# EAGLE design hoperf-rfm9x-lora-breakout (EAGLE 7.6.0)
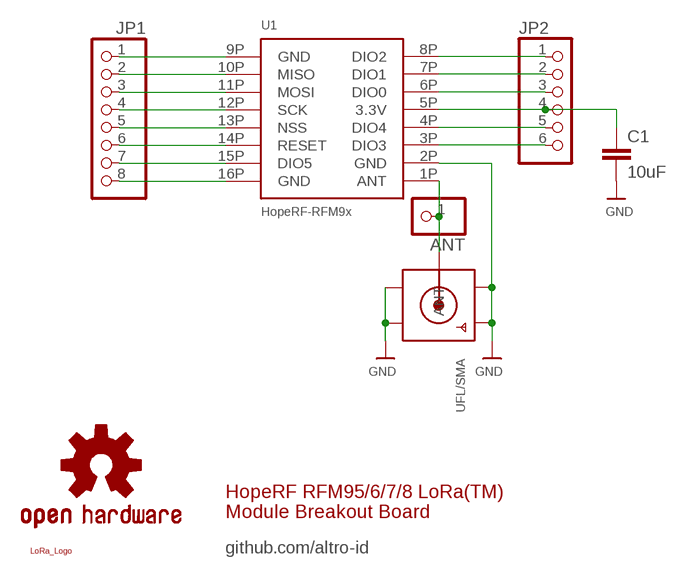
[diagram p0: schematic, sheet 1]

## Parts
ANT  HEADER-1X1ROUND  [1X01_ROUND]
C1  10uF  CAP0805  [0805_MP]
JP1  HEADER-1X876MIL  [1X08_ROUND_76]
JP2  HEADER-1X676MIL  [1X06_ROUND_76]
LOGO1  OSHW-LOGOS  [OSHW-LOGO-S]
U1  HopeRF-RFM9x  RFM9X_LORA  [RFM9X_SMT]
U$3  LORA_LOGO  [LORA_LOGO]
UFL/SMA  MICROBUILDER_SMACONNECTOR_EDGE_UFL  [MICROBUILDER_SMA_EDGELAUNCH_UFL]

## Nets
3.3V: C1.1 JP2.4 U1.5P(3.3V)
DIO0: JP2.3 U1.6P(DIO0)
DIO1: JP2.2 U1.7P(DIO1)
DIO2: JP2.1 U1.8P(DIO2)
DIO3: JP2.6 U1.3P(DIO3)
DIO4: JP2.5 U1.4P(DIO4)
DIO5: JP1.7 U1.15P(DIO5)
GND: C1.2 JP1.1 JP1.8 U1.2P(GND) U1.9P(GND) U1.16P(GND) UFL/SMA.GND@1(GND1) UFL/SMA.GND@2(GND2) UFL/SMA.GND@3(GND3) UFL/SMA.GND@4(GND4)
MISO: JP1.2 U1.10P(MISO)
MOSI: JP1.3 U1.11P(MOSI)
N$17: ANT.1 U1.1P(ANT) UFL/SMA.P(ANT)
NSS: JP1.5 U1.13P(NSS)
RESET: JP1.6 U1.14P(RESET)
SCK: JP1.4 U1.12P(SCK)

## Notes on the sheet
- HopeRF RFM95/6/7/8 LoRa(TM)
  Module Breakout Board
- github.com/altro-id

## Library data of the parts
ANT = microbuilder:HEADER-1X1: PIN HEADER
C1 = #afb-Passives:CAP
JP1 = microbuilder:HEADER-1X8: PIN HEADER
JP2 = microbuilder:HEADER-1X6: PIN HEADER
LOGO1 = SparkFun-Aesthetics:OSHW-LOGO: Open-Source Hardware (OSHW) Logo This logo indicates the piece of hardware it is found on incorporates a OSHW license and/or adheres to the definition of open source hardware found here: http://freedomdefined.org/OSHW
U1 = #afb-Boards:RFM9X_LORA: HopeRF RFM95/96/97/98 LoRa Module
U$3 = #afb-Aesthetics:LORA_LOGO
UFL/SMA = #afb-Connectors:MICROBUILDER_SMACONNECTOR: SMA Connector 90° DIP SMA Connector, 50 Ohm (4UConnector: 07259)

## Board
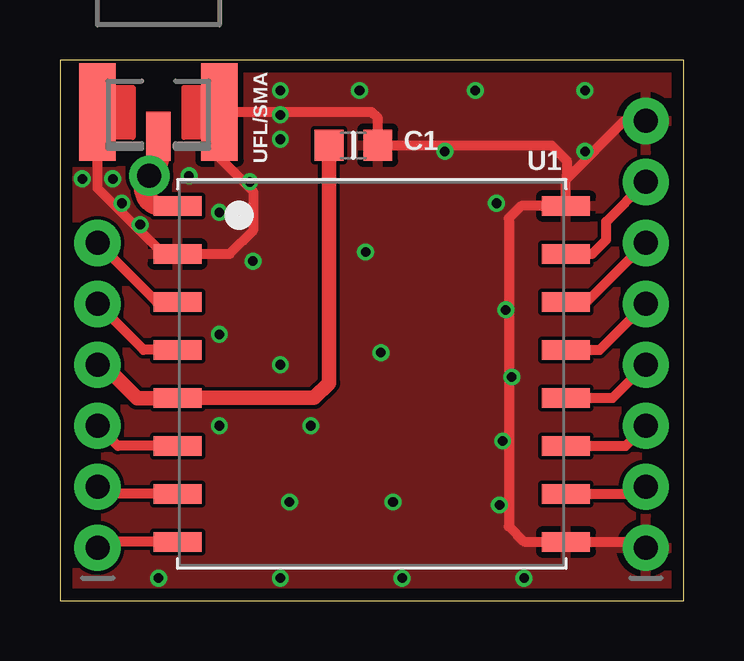
[diagram p1: board, top side]
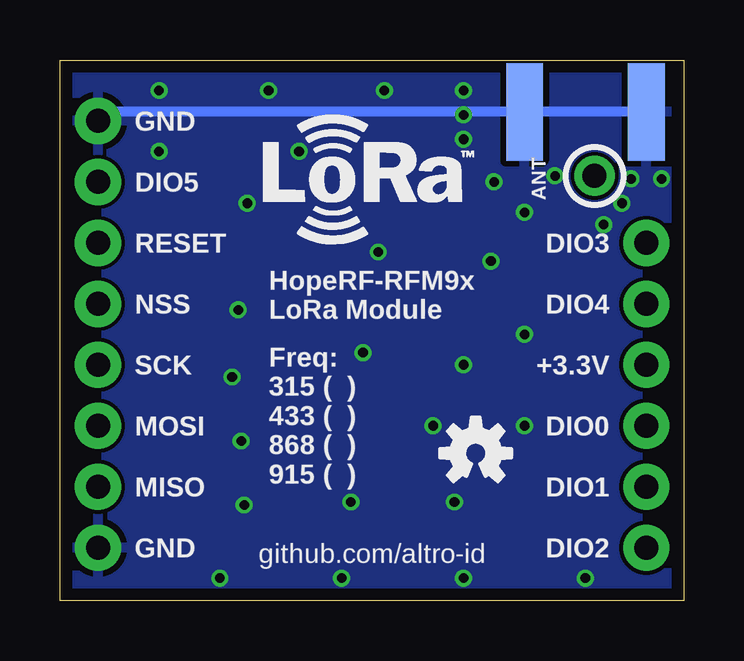
[diagram p2: board, bottom side, seen from below]

Size 26.02 x 22.53 mm. Coordinates in mm from the lower left corner, seen from the top.
Outline: 26.02,22.53 0,22.53 0,0 26.02,0 26.02,22.53
Copper layers (1*16): Top 0.035mm / dielectric 1.6mm / Bottom 0.035mm
Design rules "Elecrow_2-layer_PCB_eagle_rule": minimum track width 6mil, minimum drill 12mil, track to track 6mil, track to pad 6mil, pad to pad 6mil, via to via 8mil, smd to smd 0mil, copper to edge 20mil, drill to drill 10mil, minimum pad ring 6mil, minimum via ring 6mil, stop-mask expansion 0mil, vias tented up to drill 100mil, thermal gap 10mil

### Footprints (pad centres in the part's own frame; a part is rotated, then mirrored left to right if it is on the bottom)
1X01_ROUND = drill 1 pad 1.676: 1 0,0
0805_MP = smd 1.2 x 1.3: 1 -1.016,0; 2 1.016,0
1X08_ROUND_76 = drill 1 pad 1.93: 1 -8.89,0; 2 -6.35,0; 3 -3.81,0; 4 -1.27,0; 5 1.27,0; 6 3.81,0; 7 6.35,0; 8 8.89,0
1X06_ROUND_76 = drill 1 pad 1.93: 1 -6.35,0; 2 -3.81,0; 3 -1.27,0; 4 1.27,0; 5 3.81,0; 6 6.35,0
RFM9X_SMT = smd 2 x 0.8: 1P 8.1,-7; 2P 8.1,-5; 3P 8.1,-3; 4P 8.1,-1; 5P 8.1,1; 6P 8.1,3; 7P 8.1,5; 8P 8.1,7; 9P -8.1,7; 10P -8.1,5; 11P -8.1,3; 12P -8.1,1; 13P -8.1,-1; 14P -8.1,-3; 15P -8.1,-5; 16P -8.1,-7
MICROBUILDER_SMA_EDGELAUNCH_UFL = smd 4.064 x 1.524: GND@1 2.032,-2.54; GND@2 2.032,2.54 | smd 4.064 x 1.524 bottom: GND@3 2.032,2.54; GND@4 2.032,-2.54 | smd 2.032 x 1.016: P 3.048,0

### Placement (x,y rotation side)
ANT  3.73,17.7 180 top
C1  12.24,18.97 0 top
JP1  24.43,11.1 90 top
JP2  1.57,8.56 90 top
LOGO1  8.68,6.15 0 bottom
U1  13,9.45 180 top
U$3  17.95,14.15 0 bottom
UFL/SMA  4.11,22.4 270 top

### Tracks (layer width: path | path; a pad name or v marks a point on that pad's centre or on a via)
3.3V
  Top 0.406: 4.91,8.43 U1.5P
  Top 0.61: JP2.4 1.82,9.83 3.22,8.43 4.88,8.43 U1.5P 10.6,8.45 11.22,9.07 C1.1
DIO0
  Top 0.406: U1.6P 2.41,6.45 JP2.3
DIO1
  Top 0.406: U1.7P 1.87,4.45 JP2.2
DIO2
  Top 0.406: U1.8P 1.81,2.45 JP2.1
DIO3
  Top 0.406: U1.3P 4.03,12.45 JP2.6
DIO4
  Top 0.406: U1.4P 3.49,10.45 JP2.5
DIO5
  Top 0.406: U1.15P 22.19,14.45 22.78,15.04 22.78,15.8 JP1.7
GND  (via drill 0.4)
  Top 0.406: JP1.1 24.19,2.45 U1.9P 21.08,2.46 19.35,2.46 18.71,3.1 18.71,15.93 19.24,16.45 U1.16P 21.1,17.55 21.19,17.64 | 21.19,17.64 23.54,19.99 JP1.8 | 21.19,17.64 21.13,17.7 21.13,18.34 20.49,18.97 C1.2 13.25,20.12 13,20.37 UFL/SMA.GND@3 6.65,18.47 8.04,17.07 8.04,15.42 7.08,14.45 U1.2P 4.85,14.4 4.36,14.4 1.57,17.2 UFL/SMA.GND@4
  Bottom 0.406: JP1.8 24.05,20.37 UFL/SMA.GND@3 UFL/SMA.GND@4
  other vias: 5.38,17.7 2.2,17.58 2.58,16.56 3.35,15.67 12.49,21.26 17.32,21.26 21.89,21.26 4.11,0.94 9.19,0.94 14.27,0.94 19.35,0.94 12.74,14.53 18.59,12.12 10.46,7.29 18.2,16.56 18.84,9.32 13.38,10.34 13.89,4.12 8.04,14.15 9.19,9.83 6.65,7.29 6.65,16.18 6.65,11.1 9.19,20.24 16.05,18.72 21.89,18.72 9.19,21.26 9.19,19.23 7.92,17.45 0.93,17.58 18.33,3.99 18.46,6.66 9.57,4.12
  pour Bottom: 0.3,22.53 26.97,22.53 26.97,-0.33 -0.97,-0.33 -0.97,22.53
  pour Top: -0.97,22.53 26.97,22.53 26.97,-0.33 -0.97,-0.33
MISO
  Top 0.406: U1.10P 24.13,4.45 JP1.2
MOSI
  Top 0.406: U1.11P 23.59,6.45 JP1.3
N$17
  Top 0.813: U1.1P 4.22,16.45 arc-137 ANT.1 arc68 UFL/SMA.P
NSS
  Top 0.406: U1.13P 22.51,10.45 JP1.5
RESET
  Top 0.406: U1.14P 21.97,12.45 JP1.6
SCK
  Top 0.406: U1.12P 23.05,8.45 JP1.4

### Text on the board
bNames: GND | DIO5 | ANT | DIO3 | RESET | DIO4 | NSS | HopeRF-RFM9x / LoRa Module | +3.3V | SCK | DIO0 | MOSI | DIO1 | Freq: / 315 ( ) / 433 ( ) / 868 ( ) / 915 ( ) | MISO | DIO2 | GND | github.com/altro-id